# Altium schematic sheet screen.SchDoc
size A; SheetNumber: 3; SheetTotal: 5
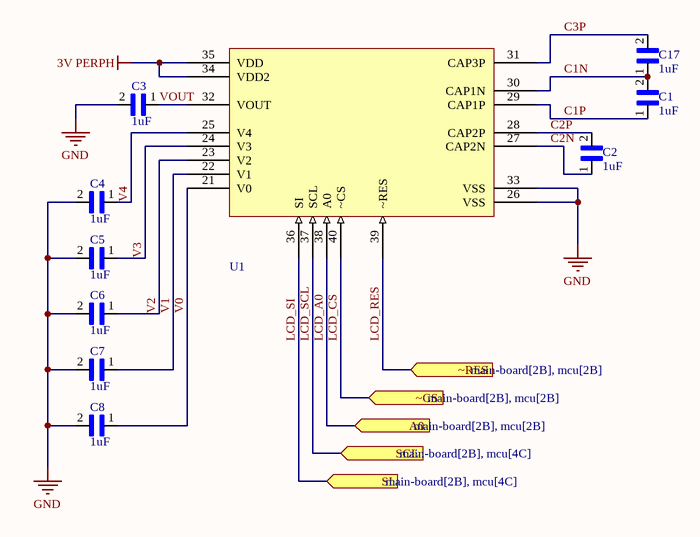
[diagram p0: screen.SchDoc]

## Parts
C1  1uF  [CAPC1608X90N]
C2  1uF  [CAPC1608X90N]
C3  1uF  [CAPC1608X90N]
C4  1uF  [CAPC1608X90N]
C5  1uF  [CAPC1608X90N]
C6  1uF  [CAPC1608X90N]
C7  1uF  [CAPC1608X90N]
C8  1uF  [CAPC1608X90N]
C17  1uF  [CAPC1608X90N]
U1  INTERFACE  [INTERFACE]  (value not drawn)

## Ports
A0 (in, see main-board[2B], mcu[2B]), SCL (in, see main-board[2B], mcu[4C]), SI (in, see main-board[2B], mcu[4C]), ~CS (in, see main-board[2B], mcu[2B]), ~RES (in, see main-board[2B], mcu[2B])

## Nets
3V PERPH: U1.34(VDD2) U1.35(VDD)
GND: C3.2 C4.2 C5.2 C6.2 C7.2 C8.2 U1.26(VSS) U1.33(VSS)
C1N: C1.2 C17.1 U1.30(CAP1N)
C1P: C1.1 U1.29(CAP1P)
C2N: C2.1 U1.27(CAP2N)
C2P: C2.2 U1.28(CAP2P)
C3P: C17.2 U1.31(CAP3P)
LCD_A0: U1.38(A0) ; port A0
LCD_CS: U1.40(~CS) ; port ~CS
LCD_RES: U1.39(~RES) ; port ~RES
LCD_SCL: U1.37(SCL) ; port SCL
LCD_SI: U1.36(SI) ; port SI
V0: C8.1 U1.21(V0)
V1: C7.1 U1.22(V1)
V2: C6.1 U1.23(V2)
V3: C5.1 U1.24(V3)
V4: C4.1 U1.25(V4)
VOUT: C3.1 U1.32(VOUT)

## Library data of the parts
C1-C8 C17 = CL10B105KP8NNNC: Package: None; Price: None; Value: *; MP: CL10B105KP8NNNC; Availability: Unavailable